# EAGLE design CS_ANT (EAGLE 9.5.0)
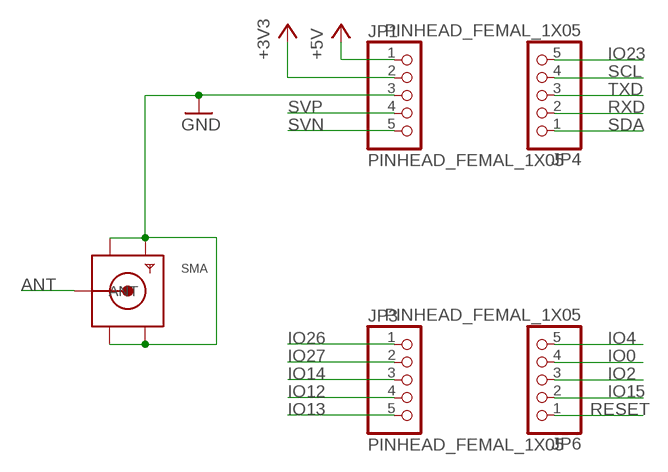
[diagram p0: schematic, sheet 1]

## Parts
JP1  PINHEAD_FEMAL_1X05  [1X05F]
JP3  PINHEAD_FEMAL_1X05  [1X05F]
JP4  PINHEAD_FEMAL_1X05  [1X05F]
JP6  PINHEAD_FEMAL_1X05  [1X05F]
SMA  SMACONNECTOR  [SMA90_DIP]

## Nets
+3V3: JP1.2
+5V: JP1.1
ANT: SMA.ANTENNA(ANT)
GND: JP1.3 SMA.GND1 SMA.GND2 SMA.GND3 SMA.GND4
IO0: JP6.4
IO2: JP6.3
IO4: JP6.5
IO12: JP3.4
IO13: JP3.5
IO14: JP3.3
IO15: JP6.2
IO23: JP4.5
IO26: JP3.1
IO27: JP3.2
RESET: JP6.1
RXD: JP4.2
SCL: JP4.4
SDA: JP4.1
SVN: JP1.5
SVP: JP1.4
TXD: JP4.3

## Library data of the parts
JP1 JP3 JP4 JP6 = SamacSys_3D:PINHEAD_FEMAL_1X05
SMA = adafruit:SMACONNECTOR: SMA Connector 90° DIP SMA Connector, 50 Ohm (4UConnector: 07259)

## Board
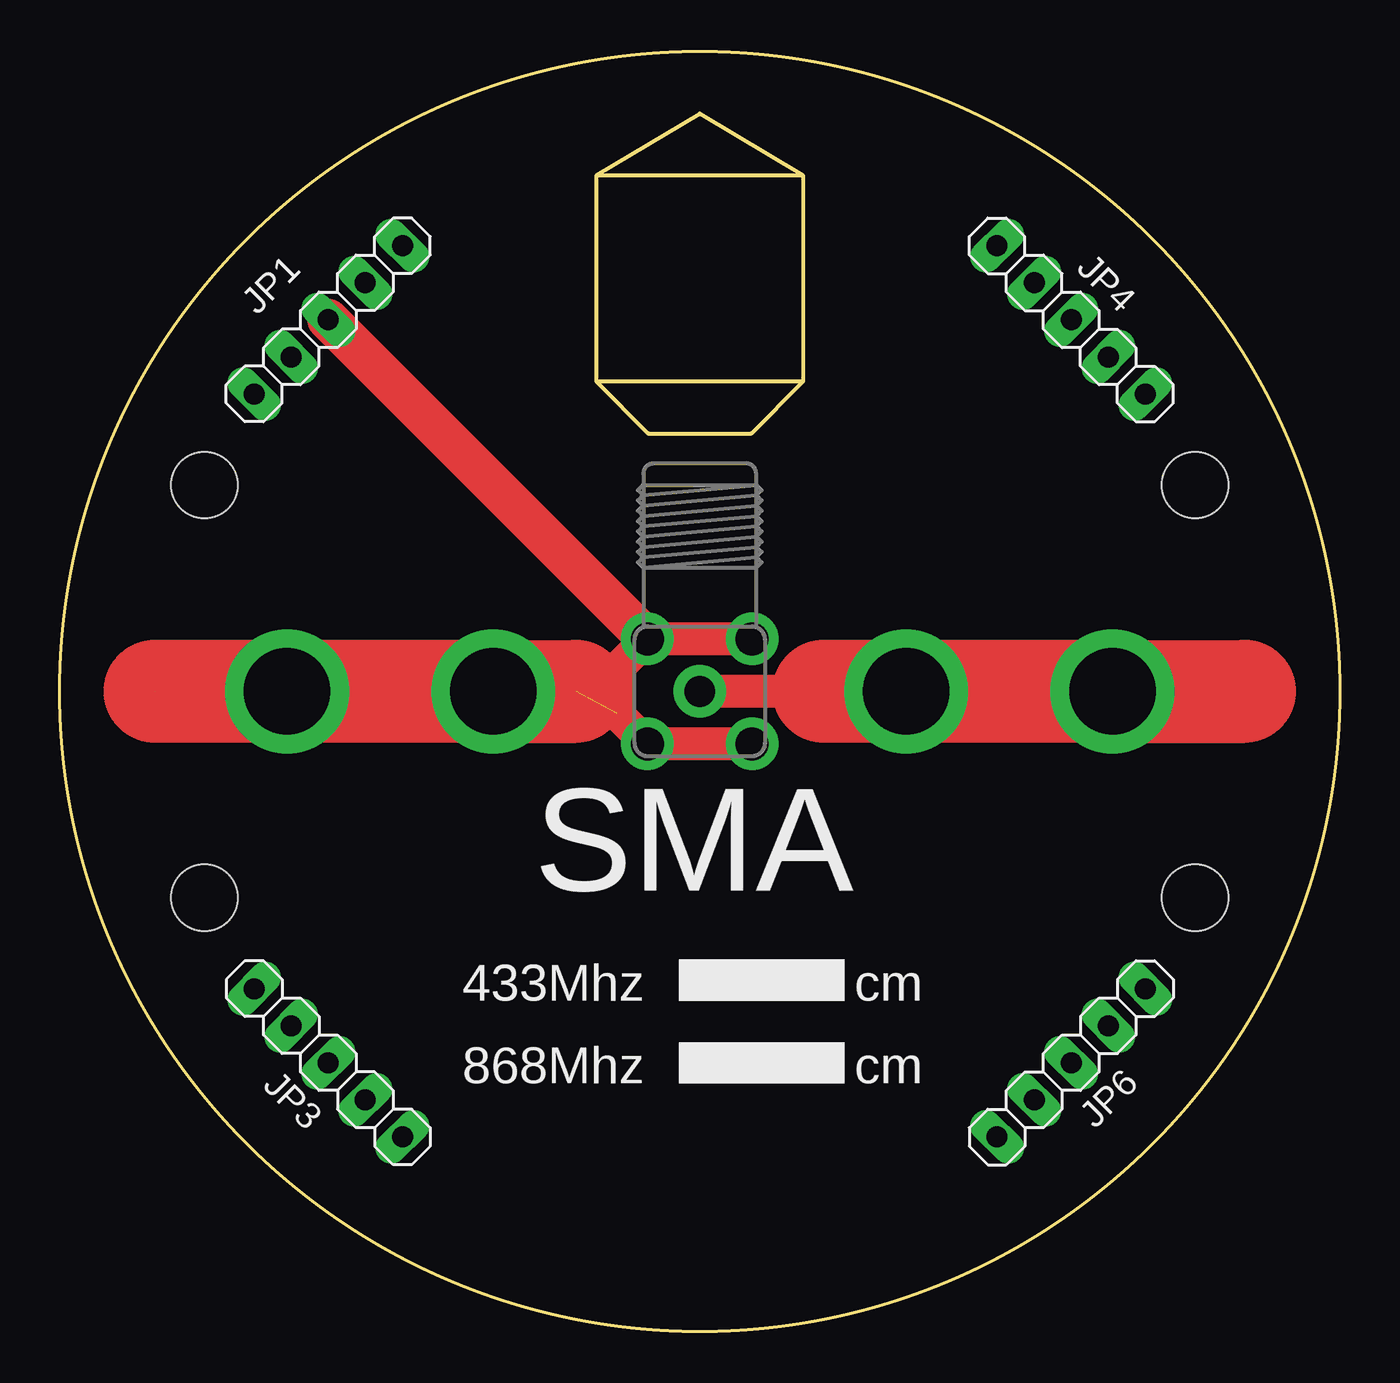
[diagram p1: board, top side]
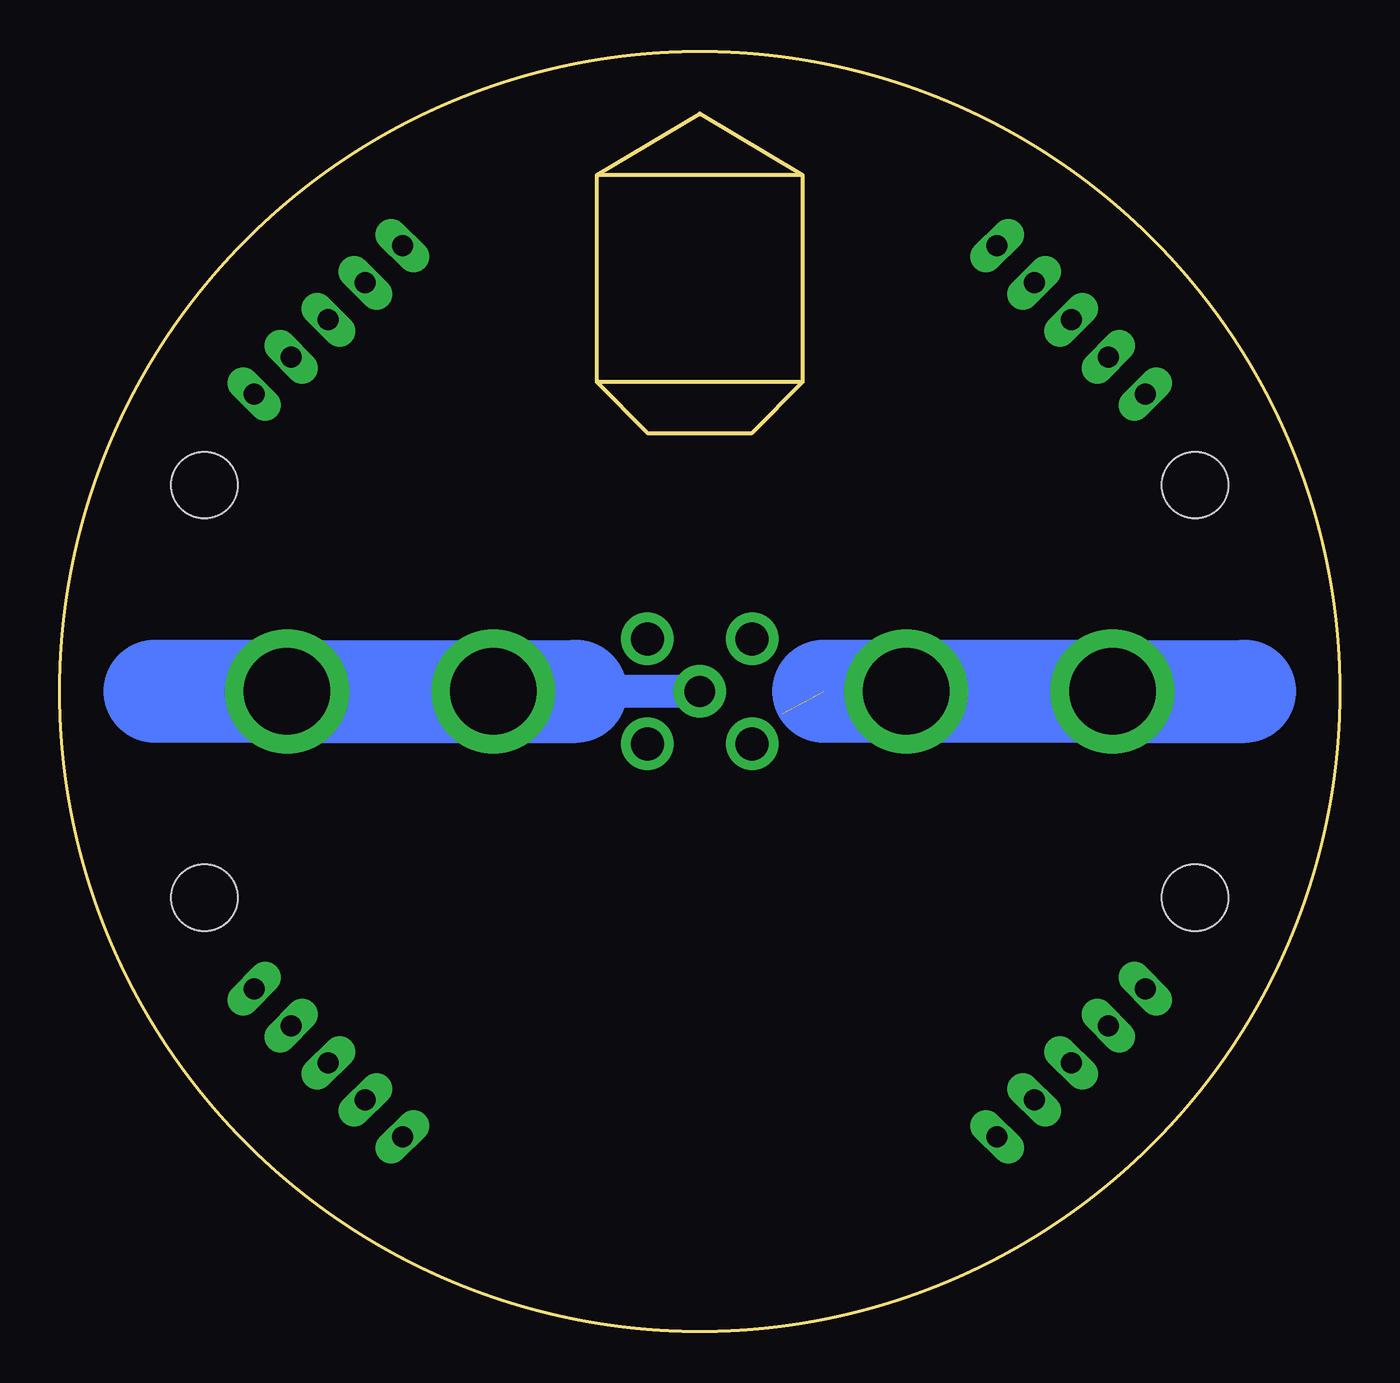
[diagram p2: board, bottom side, seen from below]

Size 62 x 62 mm. Coordinates in mm from the lower left corner, seen from the top.
Outline: 26,56 36,56
Outline: 36,56 36,46
Outline: 36,46 26,46
Outline: 26,46 26,56
Outline: 26,46 28.5,43.5 33.5,43.5 36,46
Outline: 26,56 31,59 36,56
Outline: circle at 31,31 radius 31
Copper layers (1*16): Top 0.035mm / dielectric 1.5mm / Bottom 0.035mm
Design rules "CanSat": minimum track width 0.4mm, minimum drill 0.35mm, track to track 8mil, track to pad 10mil, pad to pad 8mil, via to via 15mil, smd to smd 6mil, copper to edge 1.5mm, drill to drill 10mil, minimum pad ring 10mil, minimum via ring 8mil, stop-mask expansion 6mil, vias tented up to drill 0mil, thermal gap 8mil
Holes 3.2 mm at 7,41 55,41 55,21 7,21

### Footprints (pad centres in the part's own frame; a part is rotated, then mirrored left to right if it is on the bottom)
1X05F = drill 1.016 long: 1 -5.08,0; 2 -2.54,0; 3 0,0; 4 2.54,0; 5 5.08,0
SMA90_DIP = drill 1.5 pad 2.54: ANTENNA 0,0 | drill 1.6 pad 2.54: GND1 -2.54,2.54; GND2 2.54,2.54; GND3 -2.54,-2.54; GND4 2.54,-2.54

### Placement (x,y rotation side)
JP1  13,49 225 top
JP3  13,13 315 top
JP4  49,49 135 top
JP6  49,13 45 top
SMA  31,31 0 top

### Tracks (layer width: path | path; a pad name or v marks a point on that pad's centre or on a via)
ANT  (via drill 4.2 pad 6)
  Top 1.6: 37,31 SMA.ANTENNA
  Top 5: 37,31 v51,31 57.41,31
  Bottom 1.6: SMA.ANTENNA 37,31 v41,31 v51,31
  Bottom 5: 37,31 v51,31 57.41,31
GND  (via drill 4.2 pad 6)  (2 unrouted)
  Top 1.6: SMA.GND2 SMA.GND1 27,32.08 27,29.92 SMA.GND3 SMA.GND4
  Top 2: JP1.3 SMA.GND1
  Top 5: 25,31 v21,31 4.59,31
  Bottom 5: 25,31 v11,31 4.59,31

### Text on the board
tPlace: 433Mhz | cm | 868Mhz | cm